# EAGLE schematic LED volume bar (EAGLE 9.4.2)

## Sheet 1 of 5
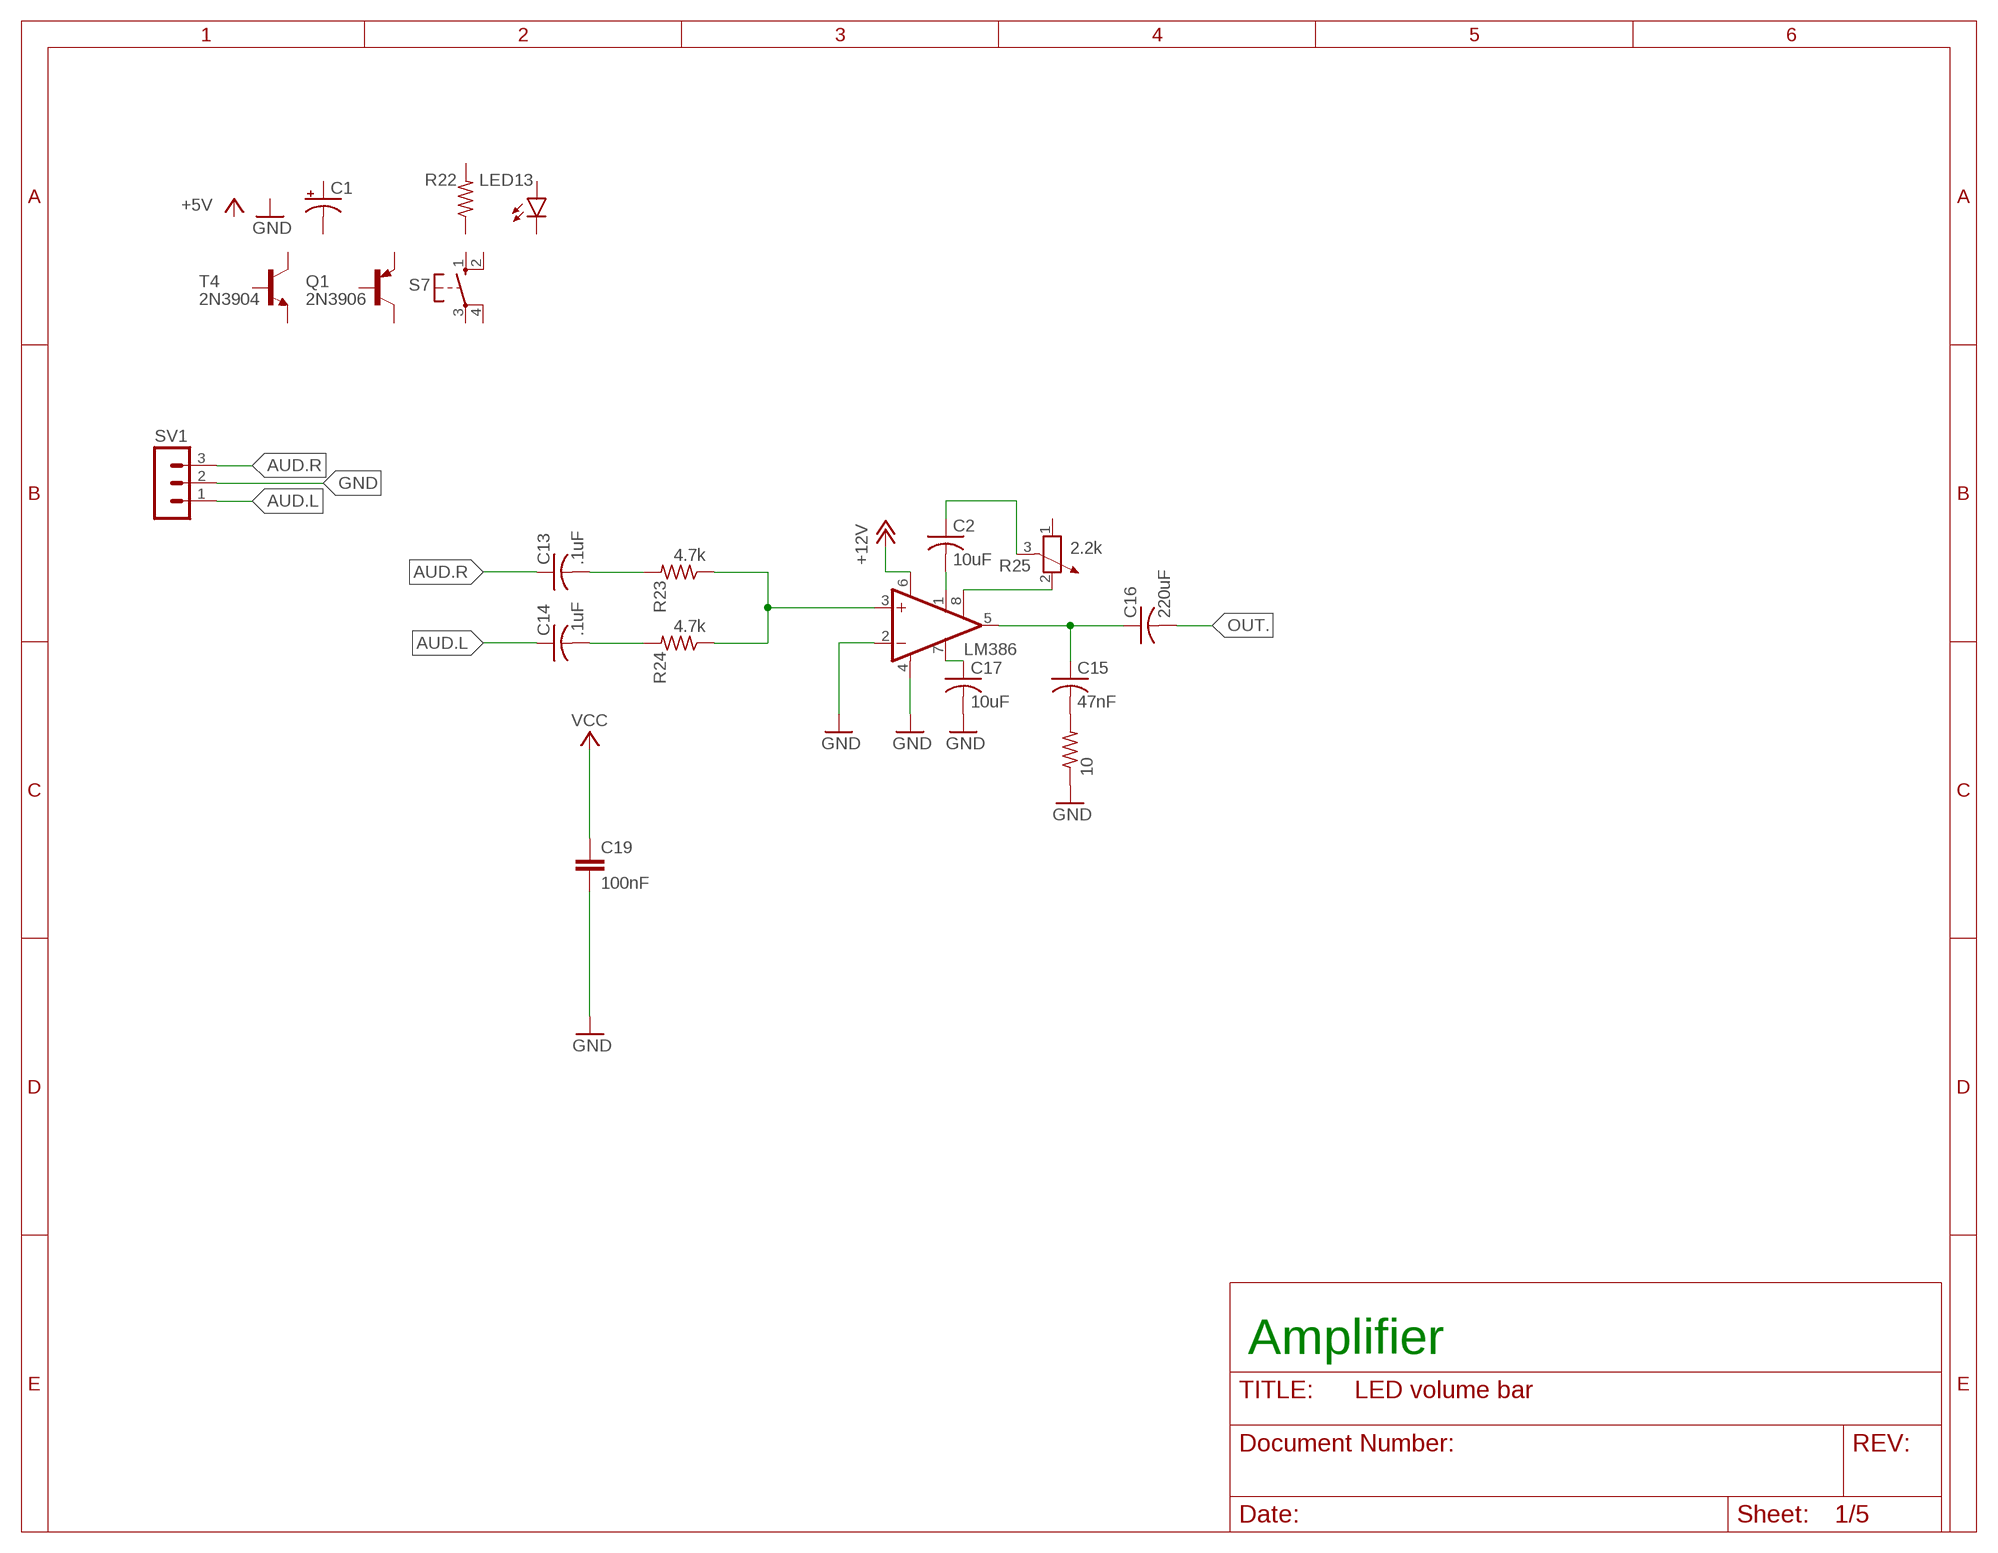
[diagram p0: schematic, sheet 1]

### Parts
C1  CPOL-USE1.8-4  [E1,8-4]
C2  10uF  C-US050-024X044  [C050-024X044]
C13  .1uF  C-US050-024X044  [C050-024X044]
C14  .1uF  C-US050-024X044  [C050-024X044]
C15  47nF  C-US050-024X044  [C050-024X044]
C16  220uF  C-US050-024X044  [C050-024X044]
C17  10uF  C-US050-024X044  [C050-024X044]
C19  100nF  C-EU025-025X050  [C025-025X050]
LED13  LED5MM  [LED5MM]
LM386  LM386N-1  [DIL08]
Q1  2N3906  [TO92]
R22  R-US_0207/12  [0207/12]
R23  4.7k  R-US_0207/12  [0207/12]
R24  4.7k  R-US_0207/12  [0207/12]
R25  2.2k  POTENTIOMETER_PT-10S  [PT-10S]
R26  10  R-US_0207/12  [0207/12]
S7  10-XX  [B3F-10XX]
SV1  MA03-1  [MA03-1]
T4  2N3904  [TO92]

### Nets
+12V: LM386.6(VS) ; also sheet 2,3,4
AUD.L: C14.1 SV1.1
AUD.R: C13.1 SV1.3
GND: C17.2 C19.2 LM386.2(-IN) LM386.4(GND) R26.1 SV1.2 ; also sheet 2,3,4
N$31: C13.2 R23.2
N$32: C14.2 R24.2
N$33: C15.2 R26.2
N$34: LM386.3(+IN) R23.1 R24.1
N$35: C15.1 C16.1 LM386.5(OUT)
N$36: C17.1 LM386.7(BYPASS)
N$37: C2.2 LM386.1(GAIN)
N$38: LM386.8(GAIN) R25.2
N$39: C2.1 R25.3
OUT.: C16.2
VCC: C19.1
Unconnected: C1.+ C1.- LED13.A LED13.K(C) Q1.1(C) Q1.2(B) Q1.3(E) R22.1 R22.2 R25.1 S7.1(S) S7.2(S1) S7.3(P) S7.4(P1) T4.1(C) T4.2(B) T4.3(E)

### Notes on the sheet
- Amplifier

## Sheet 2 of 5
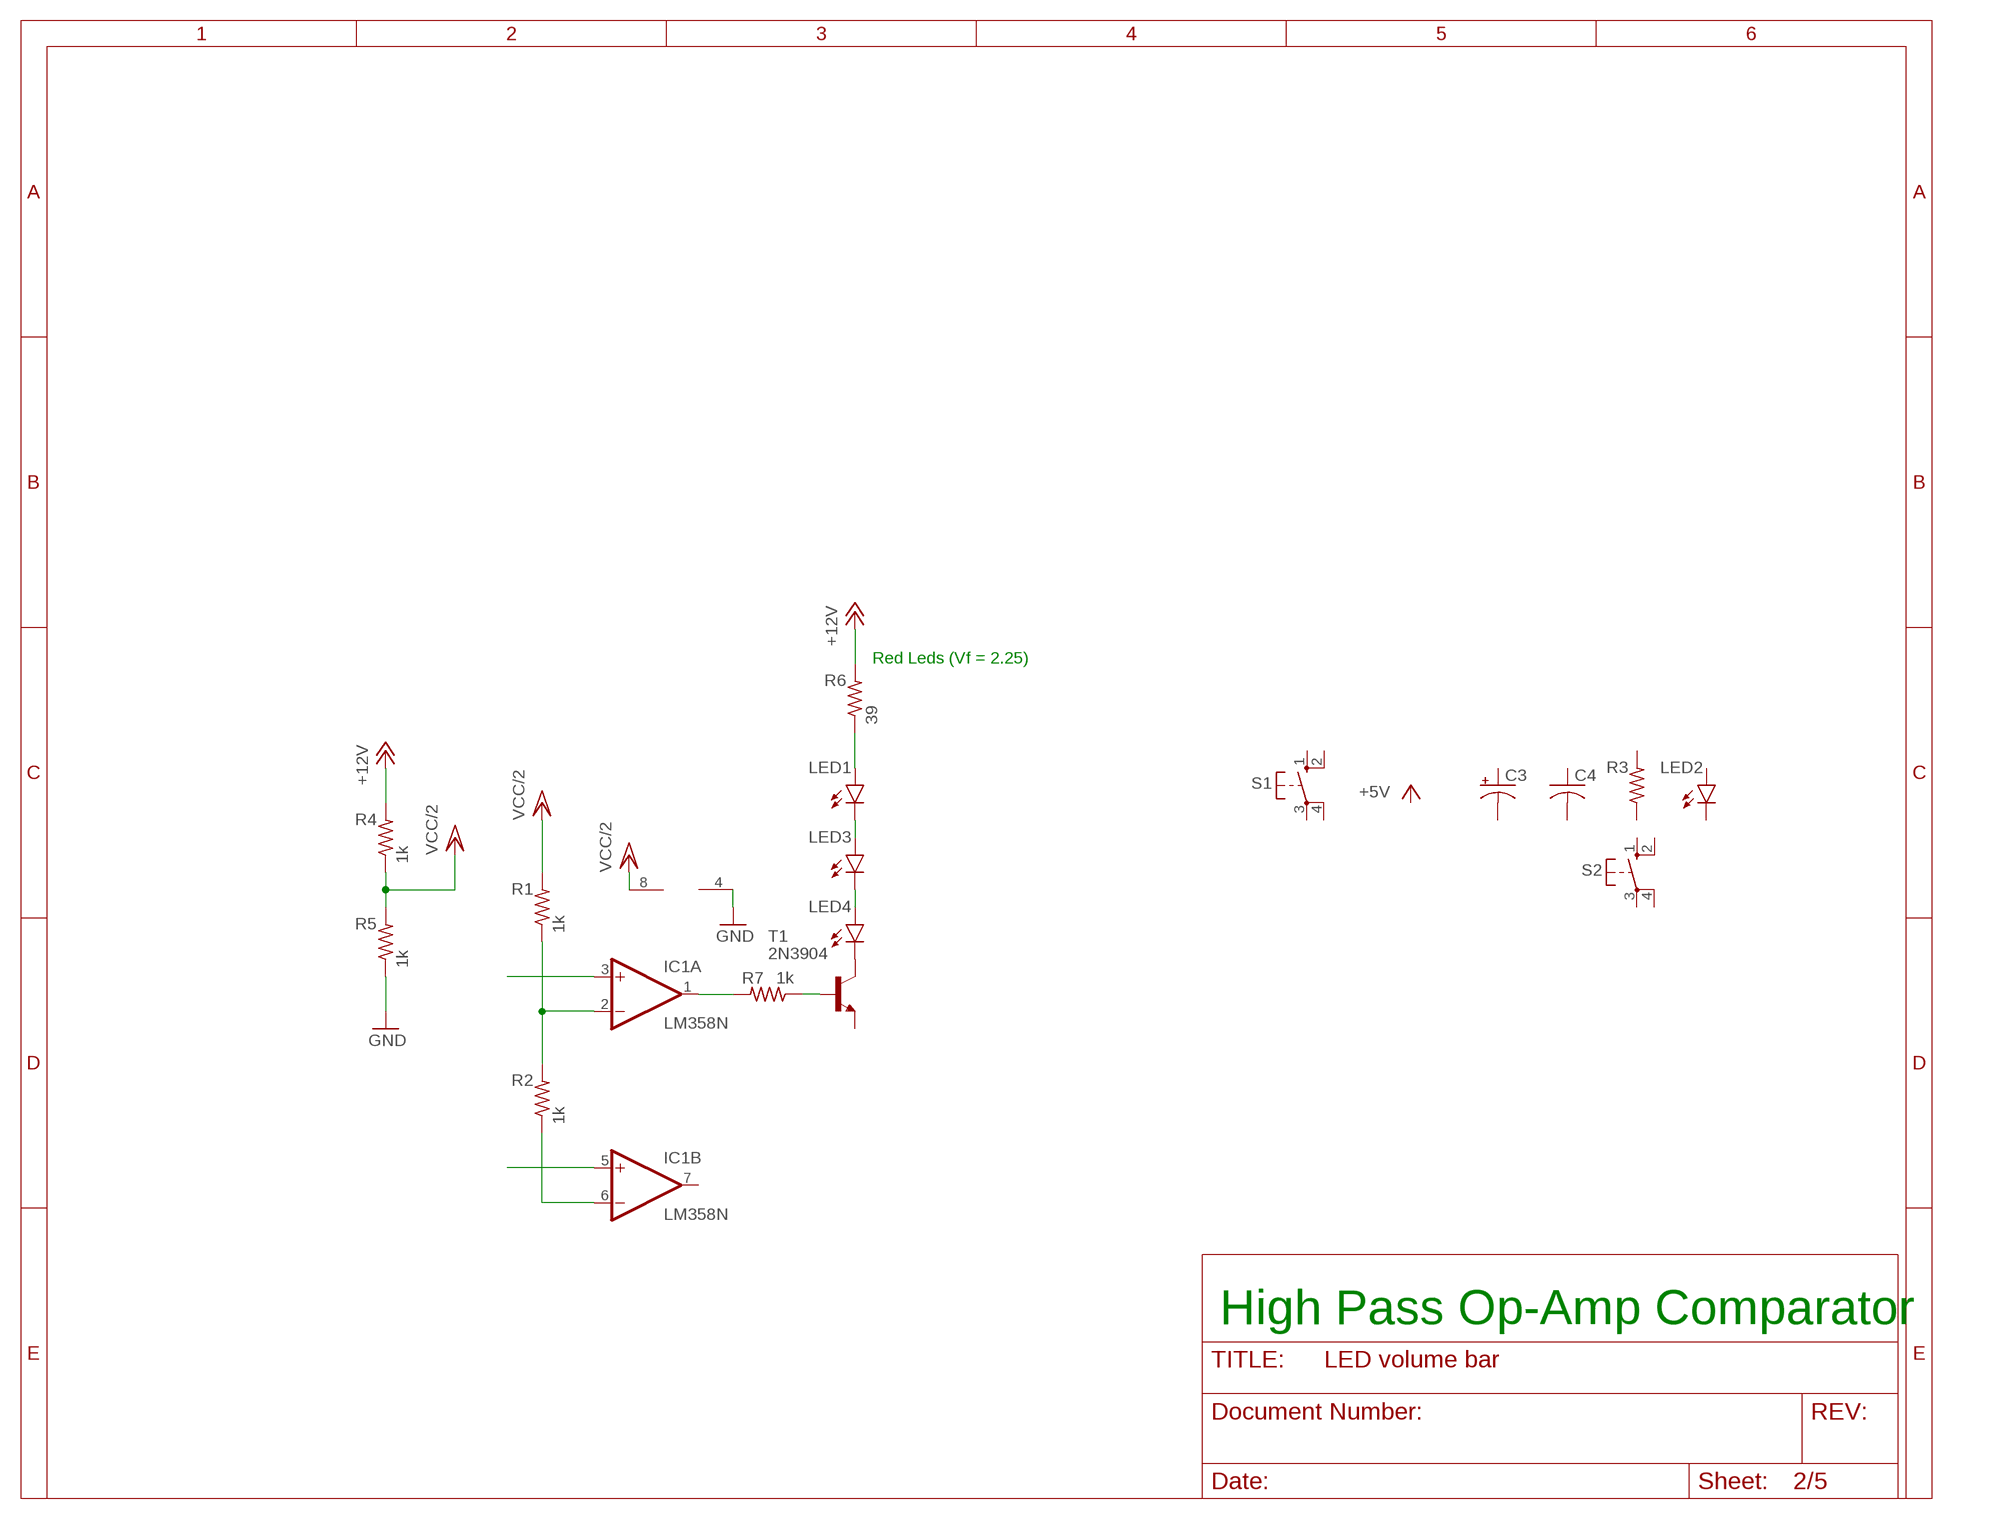
[diagram p1: schematic, sheet 2]

### Parts
C3  CPOL-USE1.8-4  [E1,8-4]
C4  C-US050-024X044  [C050-024X044]
IC1  LM358N  [DIL08]
LED1  LED5MM  [LED5MM]
LED2  LED5MM  [LED5MM]
LED3  LED5MM  [LED5MM]
LED4  LED5MM  [LED5MM]
R1  1k  R-US_0207/12  [0207/12]
R2  1k  R-US_0207/12  [0207/12]
R3  R-US_0207/12  [0207/12]
R4  1k  R-US_0207/12  [0207/12]
R5  1k  R-US_0207/12  [0207/12]
R6  39  R-US_0207/12  [0207/12]
R7  1k  R-US_0207/12  [0207/12]
S1  10-XX  [B3F-10XX]
S2  10-XX  [B3F-10XX]
T1  2N3904  [TO92]

### Nets
+12V: R4.2 R6.2 ; also sheet 1,3,4
GND: IC1.4(P:V-) R5.1 ; also sheet 1,3,4
N$1: IC1.2(A:-IN) R1.1 R2.2
N$2: IC1.6(B:-IN) R2.1
N$3: IC1.3(A:+IN)
N$4: IC1.5(B:+IN)
N$5: LED1.A R6.1
N$6: LED1.K(C) LED3.A
N$7: LED3.K(C) LED4.A
N$8: LED4.K(C) T1.1(C)
N$9: IC1.1(A:OUT) R7.2
N$10: R7.1 T1.2(B)
VCC/2: IC1.8(P:V+) R1.2 R4.1 R5.2 ; also sheet 3,4
Unconnected: C3.+ C3.- C4.1 C4.2 IC1.7(B:OUT) LED2.A LED2.K(C) R3.1 R3.2 S1.1(S) S1.2(S1) S1.3(P) S1.4(P1) S2.1(S) S2.2(S1) S2.3(P) S2.4(P1) T1.3(E)

### Notes on the sheet
- Red Leds (Vf = 2.25)
- High Pass Op-Amp Comparator

## Sheet 3 of 5
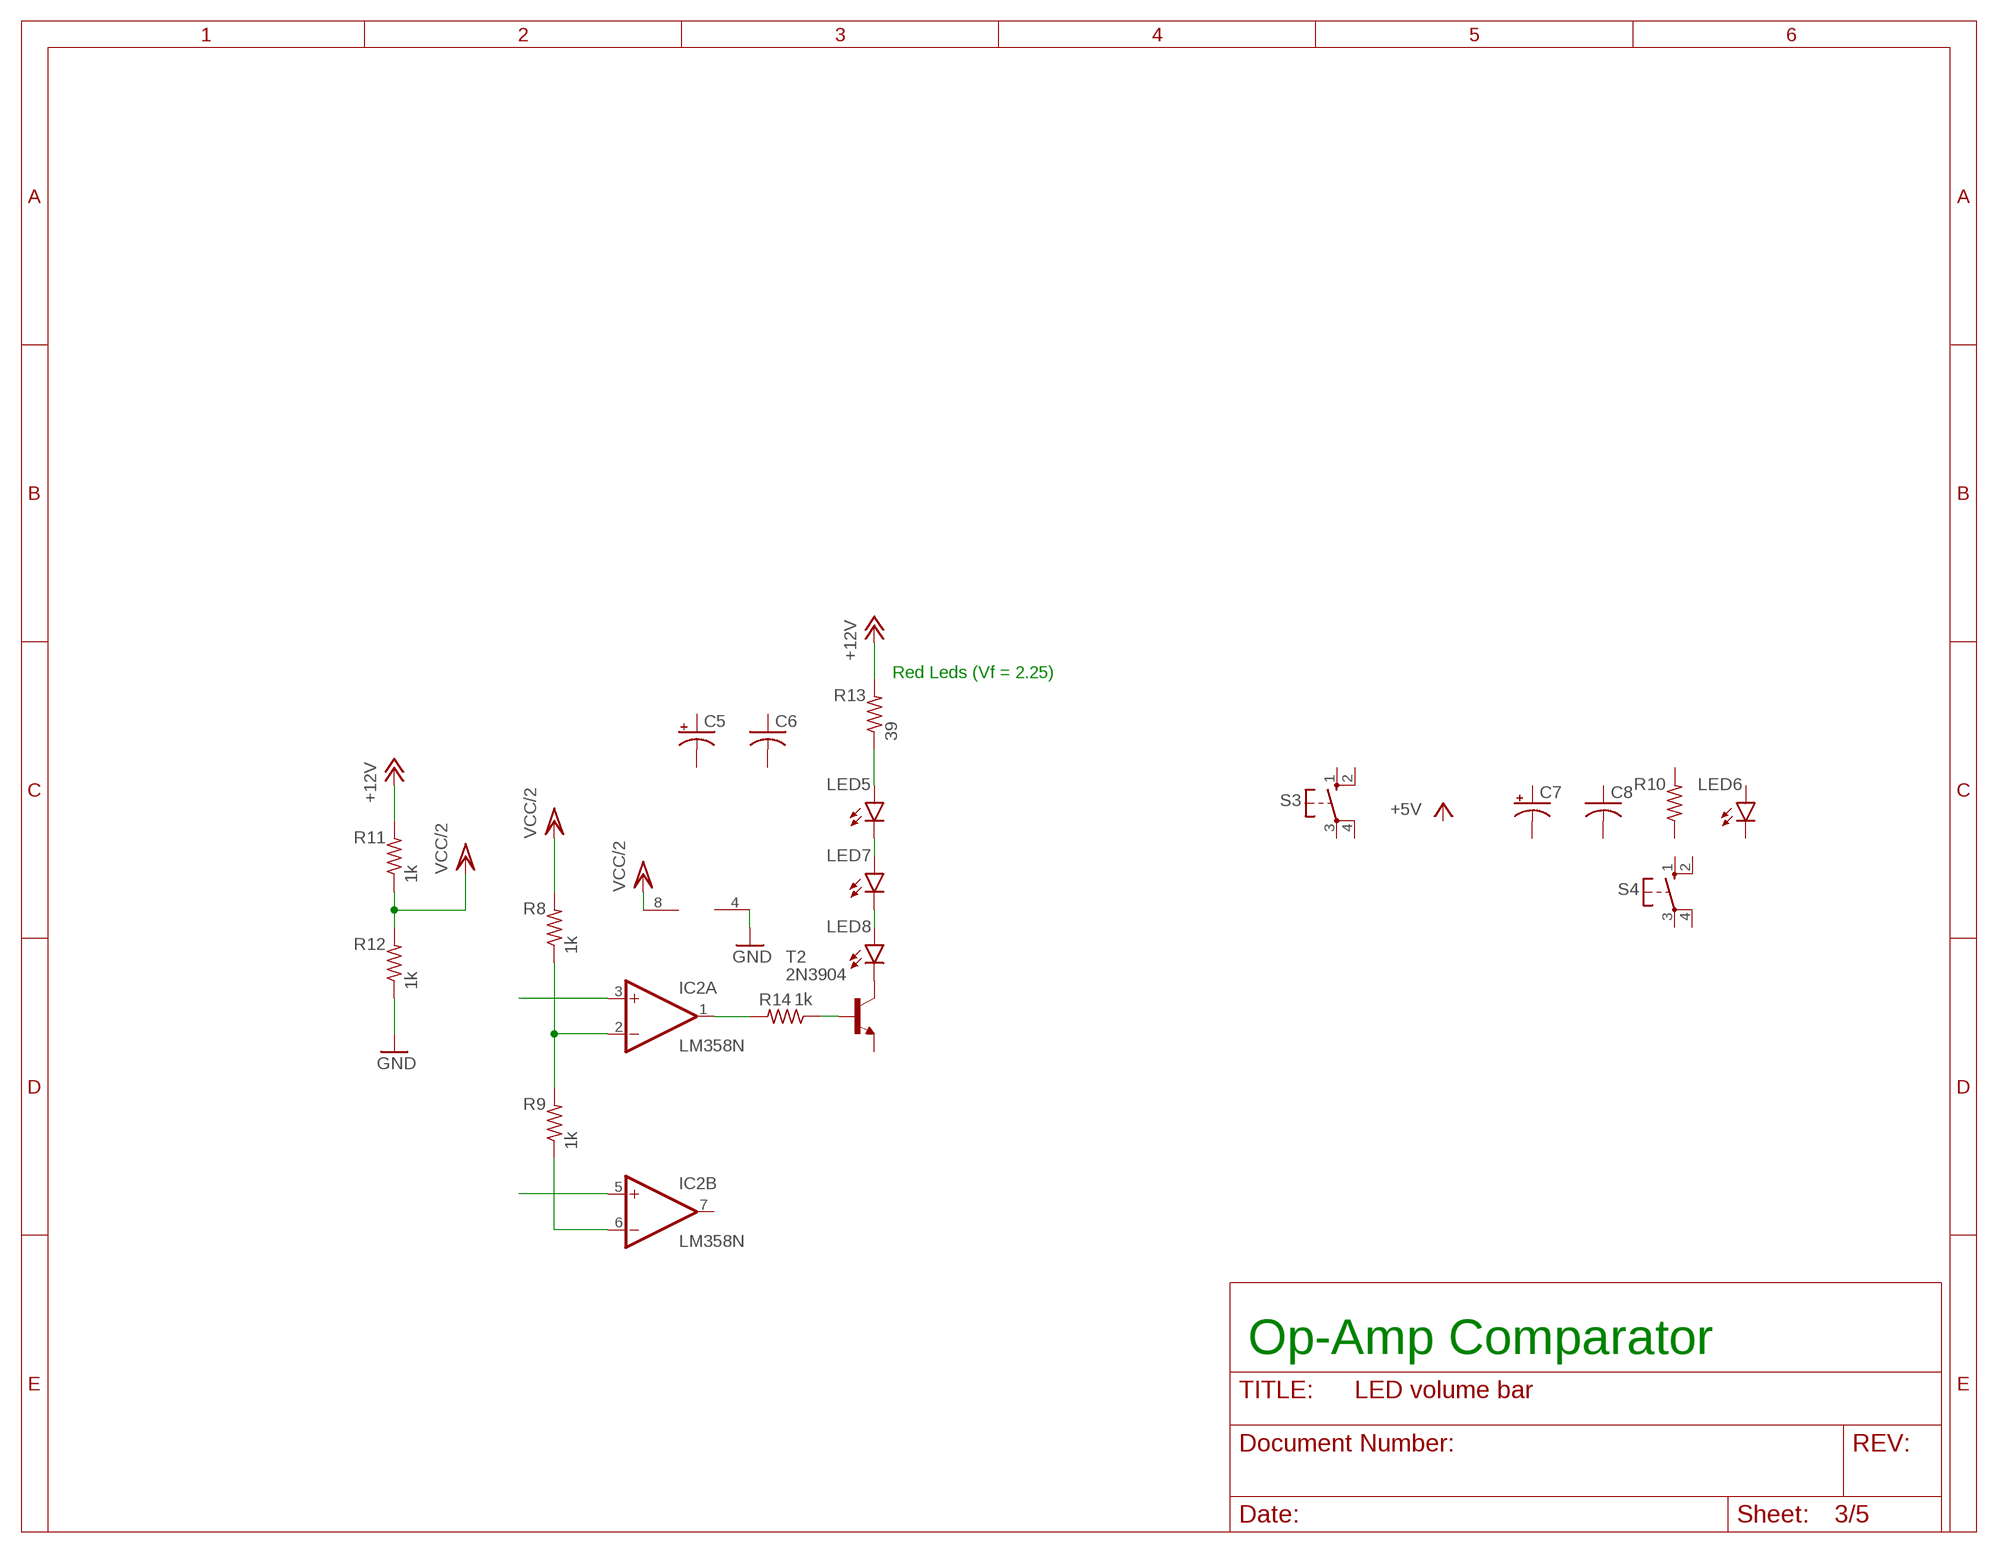
[diagram p2: schematic, sheet 3]

### Parts
C5  CPOL-USE1.8-4  [E1,8-4]
C6  C-US050-024X044  [C050-024X044]
C7  CPOL-USE1.8-4  [E1,8-4]
C8  C-US050-024X044  [C050-024X044]
IC2  LM358N  [DIL08]
LED5  LED5MM  [LED5MM]
LED6  LED5MM  [LED5MM]
LED7  LED5MM  [LED5MM]
LED8  LED5MM  [LED5MM]
R8  1k  R-US_0207/12  [0207/12]
R9  1k  R-US_0207/12  [0207/12]
R10  R-US_0207/12  [0207/12]
R11  1k  R-US_0207/12  [0207/12]
R12  1k  R-US_0207/12  [0207/12]
R13  39  R-US_0207/12  [0207/12]
R14  1k  R-US_0207/12  [0207/12]
S3  10-XX  [B3F-10XX]
S4  10-XX  [B3F-10XX]
T2  2N3904  [TO92]

### Nets
+12V: R11.2 R13.2 ; also sheet 1,2,4
GND: IC2.4(P:V-) R12.1 ; also sheet 1,2,4
N$11: IC2.2(A:-IN) R8.1 R9.2
N$12: IC2.6(B:-IN) R9.1
N$13: IC2.3(A:+IN)
N$14: IC2.5(B:+IN)
N$15: LED5.A R13.1
N$16: LED5.K(C) LED7.A
N$17: LED7.K(C) LED8.A
N$18: IC2.1(A:OUT) R14.2
N$19: LED8.K(C) T2.1(C)
N$20: R14.1 T2.2(B)
VCC/2: IC2.8(P:V+) R8.2 R11.1 R12.2 ; also sheet 2,4
Unconnected: C5.+ C5.- C6.1 C6.2 C7.+ C7.- C8.1 C8.2 IC2.7(B:OUT) LED6.A LED6.K(C) R10.1 R10.2 S3.1(S) S3.2(S1) S3.3(P) S3.4(P1) S4.1(S) S4.2(S1) S4.3(P) S4.4(P1) T2.3(E)

### Notes on the sheet
- Red Leds (Vf = 2.25)
- Op-Amp Comparator

## Sheet 4 of 5
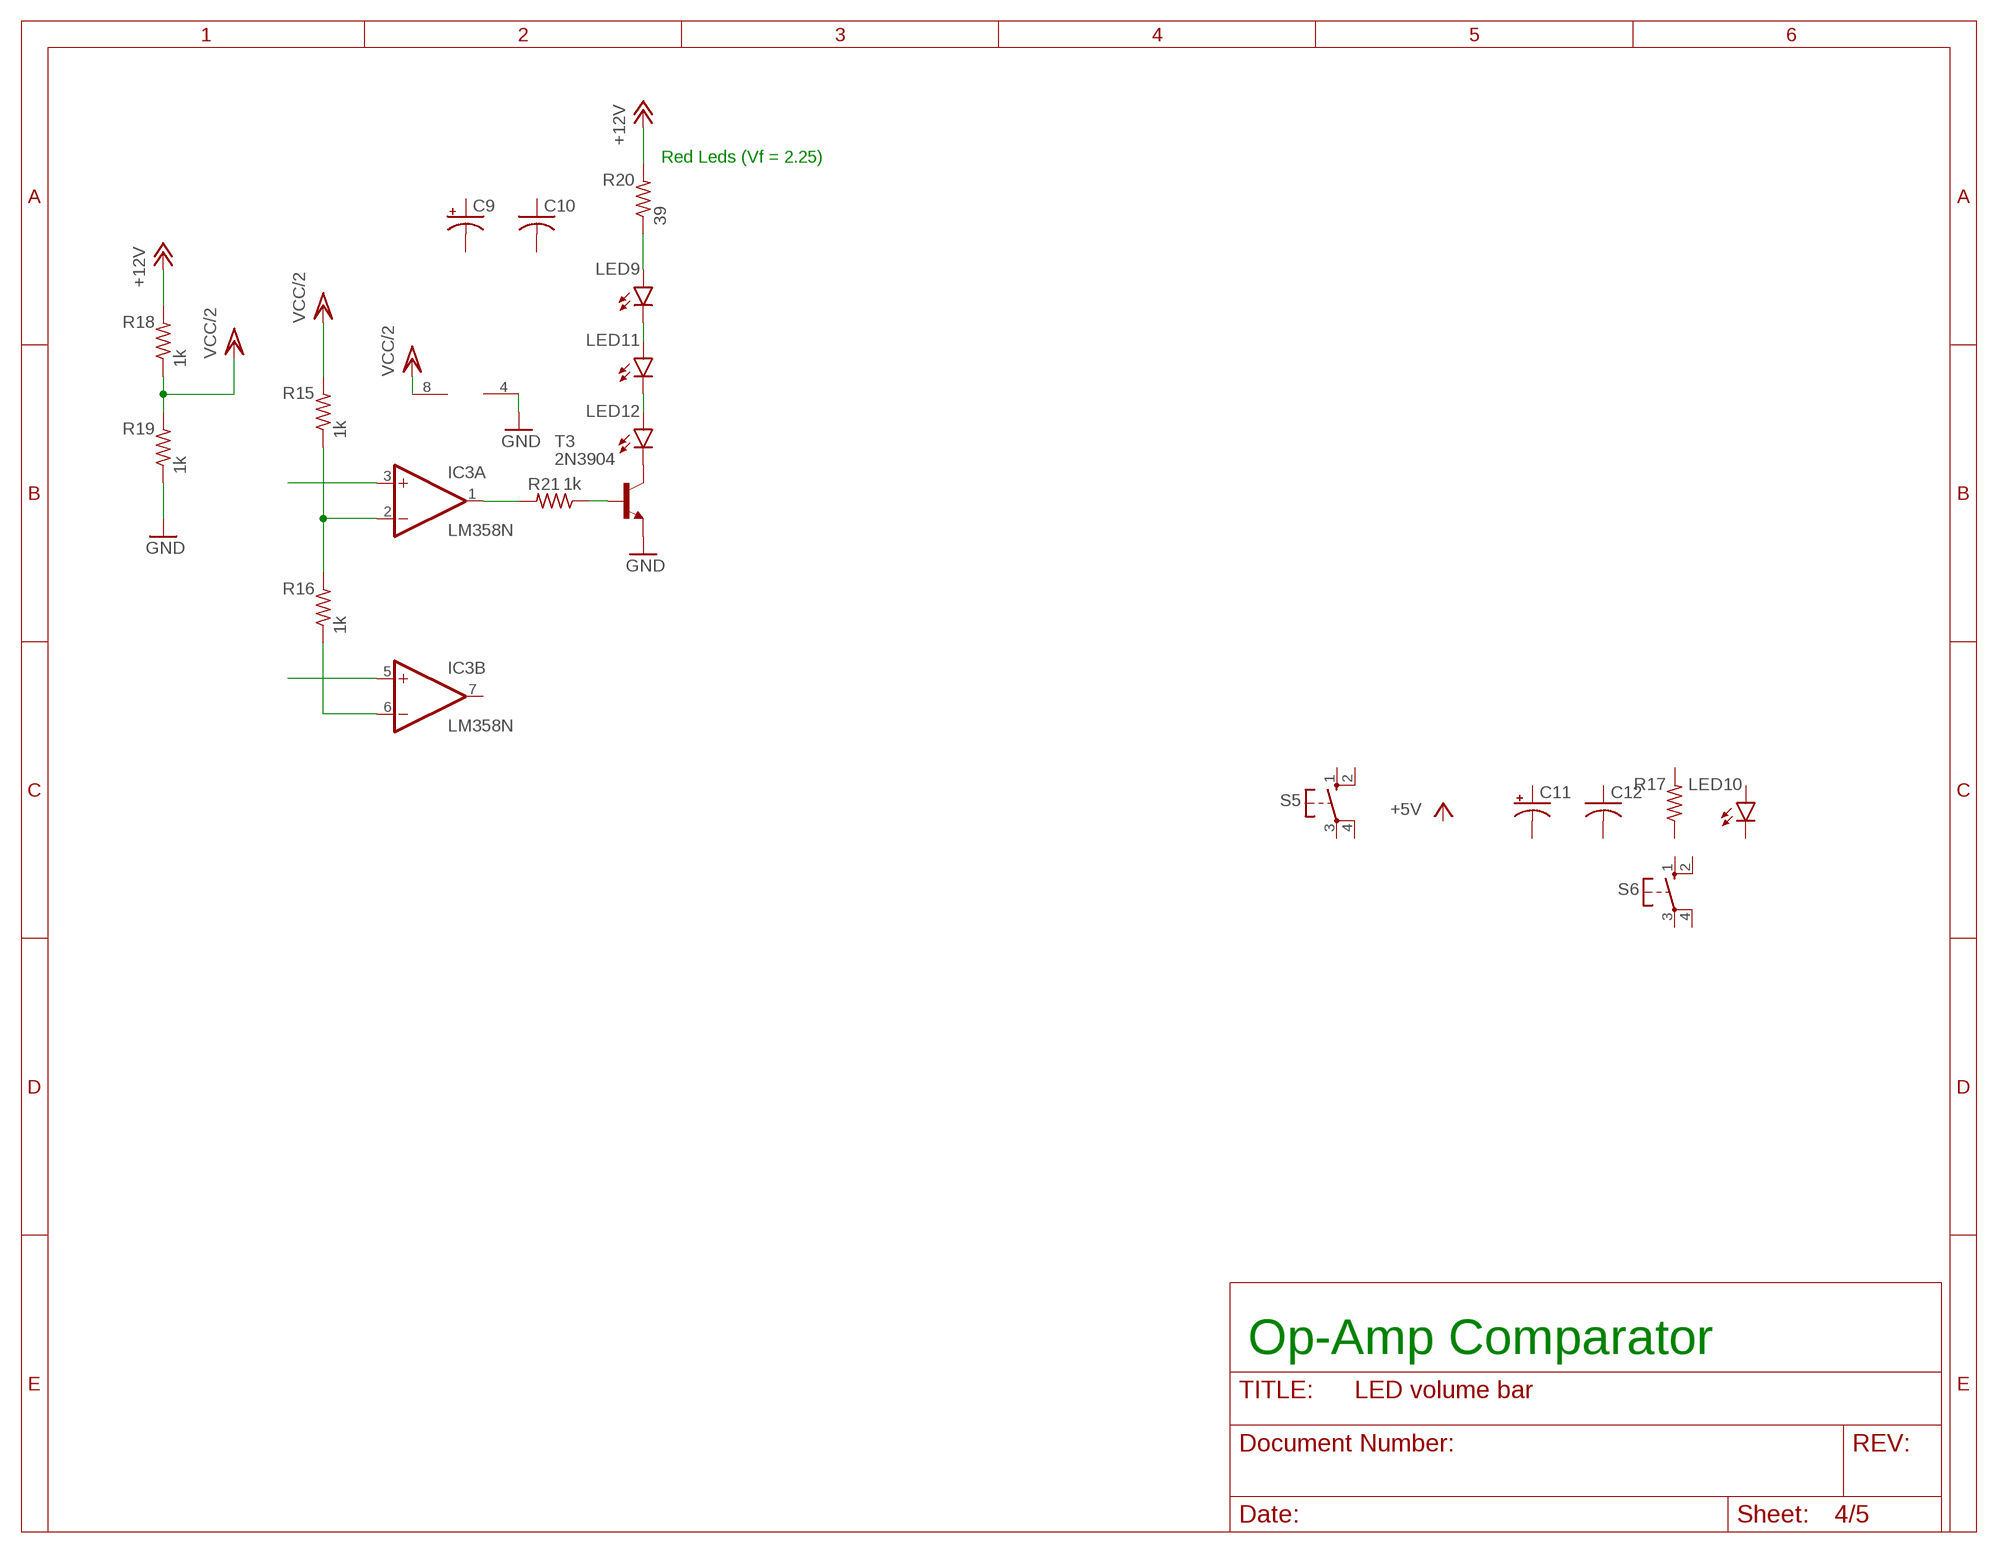
[diagram p3: schematic, sheet 4]

### Parts
C9  CPOL-USE1.8-4  [E1,8-4]
C10  C-US050-024X044  [C050-024X044]
C11  CPOL-USE1.8-4  [E1,8-4]
C12  C-US050-024X044  [C050-024X044]
IC3  LM358N  [DIL08]
LED9  LED5MM  [LED5MM]
LED10  LED5MM  [LED5MM]
LED11  LED5MM  [LED5MM]
LED12  LED5MM  [LED5MM]
R15  1k  R-US_0207/12  [0207/12]
R16  1k  R-US_0207/12  [0207/12]
R17  R-US_0207/12  [0207/12]
R18  1k  R-US_0207/12  [0207/12]
R19  1k  R-US_0207/12  [0207/12]
R20  39  R-US_0207/12  [0207/12]
R21  1k  R-US_0207/12  [0207/12]
S5  10-XX  [B3F-10XX]
S6  10-XX  [B3F-10XX]
T3  2N3904  [TO92]

### Nets
+12V: R18.2 R20.2 ; also sheet 1,2,3
GND: IC3.4(P:V-) R19.1 T3.3(E) ; also sheet 1,2,3
N$21: IC3.2(A:-IN) R15.1 R16.2
N$22: IC3.6(B:-IN) R16.1
N$23: IC3.3(A:+IN)
N$24: IC3.5(B:+IN)
N$25: LED9.A R20.1
N$26: LED9.K(C) LED11.A
N$27: LED11.K(C) LED12.A
N$28: IC3.1(A:OUT) R21.2
N$29: LED12.K(C) T3.1(C)
N$30: R21.1 T3.2(B)
VCC/2: IC3.8(P:V+) R15.2 R18.1 R19.2 ; also sheet 2,3
Unconnected: C9.+ C9.- C10.1 C10.2 C11.+ C11.- C12.1 C12.2 IC3.7(B:OUT) LED10.A LED10.K(C) R17.1 R17.2 S5.1(S) S5.2(S1) S5.3(P) S5.4(P1) S6.1(S) S6.2(S1) S6.3(P) S6.4(P1)

### Notes on the sheet
- Red Leds (Vf = 2.25)
- Op-Amp Comparator

## Sheet 5 of 5

## Library data of the parts
C1 C3 C5 C7 C9 C11 = rcl:CPOL-US: POLARIZED CAPACITOR, American symbol; SPICEPREFIX: C
C2 C4 C6 C8 C10 C12-C17 = rcl:C-US: CAPACITOR, American symbol; SPICEPREFIX: C
C19 = rcl:C-EU: CAPACITOR, European symbol
IC1-IC3 = linear:LM358: OP AMP also LM158; LM258; LM2904 Source: http://cache.national.com/ds/LM/LM158.pdf
LED1-LED13 = led:LED: LED OSRAM: - CHIPLED LG R971, LG N971, LY N971, LG Q971, LY Q971, LO R971, LY R971 LH N974, LH R974 LS Q976, LO Q976, LY Q976 LO Q996 - Hyper CHIPLED LW Q18S LB Q993, LB Q99A, LB R99A - SideLED LS A670, LO A670, LY A670, LG A670, LP A670 LB A673, LV A673, LT A673, LW A673 LH A674 LY A675 LS A676, LA A676, LO A676, LY A676, LW A676 LS A679, LY A679, LG A679 - Hyper Micro SIDELED® LS Y876, LA Y876, LO Y876, LY Y876 LT Y87S - SmartLED LW L88C, LW L88S LB L89C, LB L89S, LG L890 LS L89K, LO L89K, LY L89K LS L896, LA L896, LO L896, LY L896 - TOPLED LS T670, LO T670, LY T670, LG T670, LP T670 LSG T670, LSP T670, LSY T670, LOP T670, LYG T670 LG T671, LOG T671, LSG T671 LB T673, LV T673, LT T673, LW T673 LH T674 LS T676, LA T676, LO T676, LY T676, LB T676, LH T676, LSB T676, LW T676 LB T67C, LV T67C, LT T67C, LS T67K, LO T67K, LY T67K, LW E67C LS E67B, LA E67B, LO E67B, LY E67B, LB E67C, LV E67C, LT E67C LW T67C LS T679, LY T679, LG T679 LS T770, LO T770, LY T770, LG T770, LP T770 LB T773, LV T773, LT T773, LW T773 LH T774 LS E675, LA E675, LY E675, LS T675 LS T776, LA T776, LO T776, LY T776, LB T776 LHGB T686 LT T68C, LB T68C - Hyper Mini TOPLED® LB M676 - Mini TOPLED Santana® LG M470 LS M47K, LO M47K, LY M47K Source: http://www.osram.convergy.de LUXEON: - LUMILED® LXK2-PW12-R00, LXK2-PW12-S00, LXK2-PW14-U00, LXK2-PW14-V00 LXK2-PM12-R00, LXK2-PM12-S00, LXK2-PM14-U00 LXK2-PE12-Q00, LXK2-PE12-R00, LXK2-PE12-S00, LXK2-PE14-T00, LXK2-PE14-U00 LXK2-PB12-K00, LXK2-PB12-L00, LXK2-PB12-M00, LXK2-PB14-N00, LXK2-PB14-P00, LXK2-PB14-Q00 LXK2-PR12-L00, LXK2-PR12-M00, LXK2-PR14-Q00, LXK2-PR14-R00 LXK2-PD12-Q00, LXK2-PD12-R00, LXK2-PD12-S00 LXK2-PH12-R00, LXK2-PH12-S00 LXK2-PL12-P00, LXK2-PL12-Q00, LXK2-PL12-R00 Source: www.luxeon.com KINGBRIGHT: KA-3528ASYC Source: www.kingbright.com
LM386 = linear:LM386?-*: Low Voltage Audio Power Amplifier Source: http://cache.national.com/ds/LM/LM386.pdf
Q1 = transistor-pnp:2N3906: PNP Transistor
R1-R24 R26 = rcl:R-US_: RESISTOR, American symbol; SPICEPREFIX: R
R25 = rcl:POTENTIOMETER_: Potentiometer; SPICEMODEL: POT; SPICEPREFIX: X
S1-S7 = switch-omron:10-XX: OMRON SWITCH; MPN: B3F-1000; OC_FARNELL: 176432; OC_NEWARK: 36M3542
SV1 = con-lstb:MA03-1: PIN HEADER; OC_FARNELL: unknown; OC_NEWARK: unknown
T1-T4 = transistor:2N3904: NPN TRANSISTOR